# EAGLE design untitled (EAGLE 6.5.0)
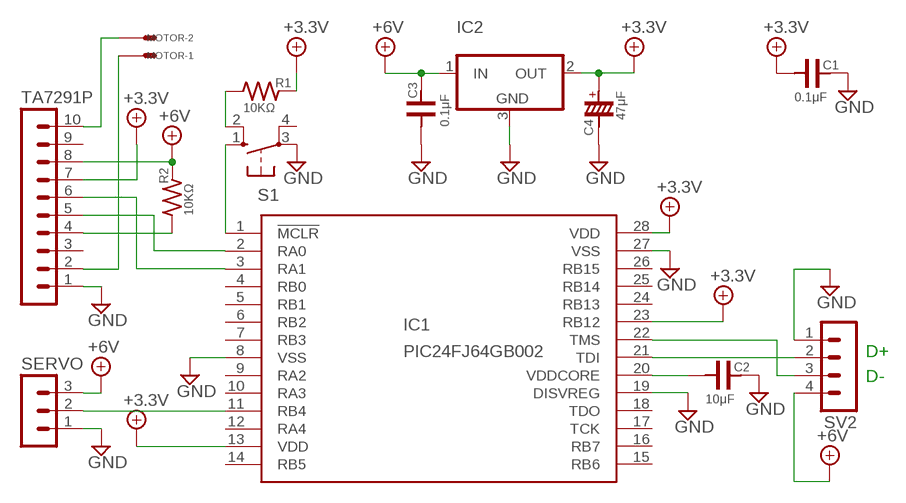
[diagram p0: schematic, sheet 1]

## Parts
C1  0.1μF  C25  [C25-25X44]
C2  10μF  C25  [C25-25X44]
C3  0.1μF  C25  [C25-25X44]
C4  47μF  POLCL  [TT2D5L]
IC1  PIC24FJ64GB002  [DIL28-3]
IC2  TA48MV  [HSIP3-P2.30B/V]
MOTOR  CON2S  [CON2]
R1  10KΩ  R  [0204/5]
R2  10KΩ  R  [0204/5]
S1  10-XX  [B3F-10XX]
SERVO  MA03-1  [MA03-1]
SV2  MA04-1  [MA04-1]
TA7291P  MA10-1  [MA10-1]

## Nets
+4.1V: C1.P$1 C4.P$1 IC1.13(VDD) IC1.23(RB12) IC1.28(VDD) IC2.2(OUT) R1.2 TA7291P.7 ; supply symbol labelled +3.3V
+5V: C3.P$2 IC2.1(IN) R2.2 SERVO.3 SV2.4 TA7291P.8 ; supply symbol labelled +6V
GND: C1.P$2 C2.P$2 C3.P$1 C4.P$2 IC1.8(VSS) IC1.19(DISVREG) IC1.27(VSS) IC2.3(GND) S1.3(P) SERVO.1 SV2.1 TA7291P.1
N$1: IC1.11(RB4) SERVO.2
N$2: R1.1 S1.2(S1)
N$3: IC1.1(!MCLR) S1.1(S)
N$4: C2.P$1 IC1.20(VDDCORE)
N$5: IC1.21(TDI) SV2.2
N$6: IC1.22(TMS) SV2.3
N$7: R2.1 TA7291P.4
N$8: IC1.2(RA0) TA7291P.5
N$9: IC1.3(RA1) TA7291P.6
N$10: MOTOR.P$1 TA7291P.2
N$11: MOTOR.P$2 TA7291P.10
Unconnected: IC1.4(RB0) IC1.5(RB1) IC1.6(RB2) IC1.7(RB3) IC1.9(RA2) IC1.10(RA3) IC1.12(RA4) IC1.14(RB5) IC1.15(RB6) IC1.16(RB7) IC1.17(TCK) IC1.18(TDO) IC1.24(RB13) IC1.25(RB14) IC1.26(RB15) S1.4(P1) TA7291P.3 TA7291P.9

## Notes on the sheet
- D+
- D-

## Library data of the parts
C1-C3 = 00_jikken:C
C4 = 00_jikken:POLC
IC1 = 00_microchip:PIC24FJ64GB002: PIC24FJ64GA002 edit this description Auto generated by make-symbol-device-package-bsdl.ulp Rev. 25 Source: PIC24FJ64GA002.bsd; MPN: PIC24FJ64GA002-I/SP; OC_FARNELL: 1332298; OC_NEWARK: 88K6132
IC2 = 00_kamiki:TA48M*: Three-Terminal Low Dropout Voltage Regulator
MOTOR = 00_jikken:CON2S
R1 R2 = 00_jikken:R
S1 = switch-omron:10-XX: OMRON SWITCH; MPN: B3F-1000; OC_FARNELL: 176432; OC_NEWARK: 36M3542
SERVO = 00_con-lstb:MA03-1: PIN HEADER; OC_FARNELL: unknown; OC_NEWARK: unknown
SV2 = 00_con-lstb:MA04-1: PIN HEADER; OC_FARNELL: unknown; OC_NEWARK: unknown
TA7291P = 00_con-lstb:MA10-1: PIN HEADER; OC_FARNELL: unknown; OC_NEWARK: unknown

## Board
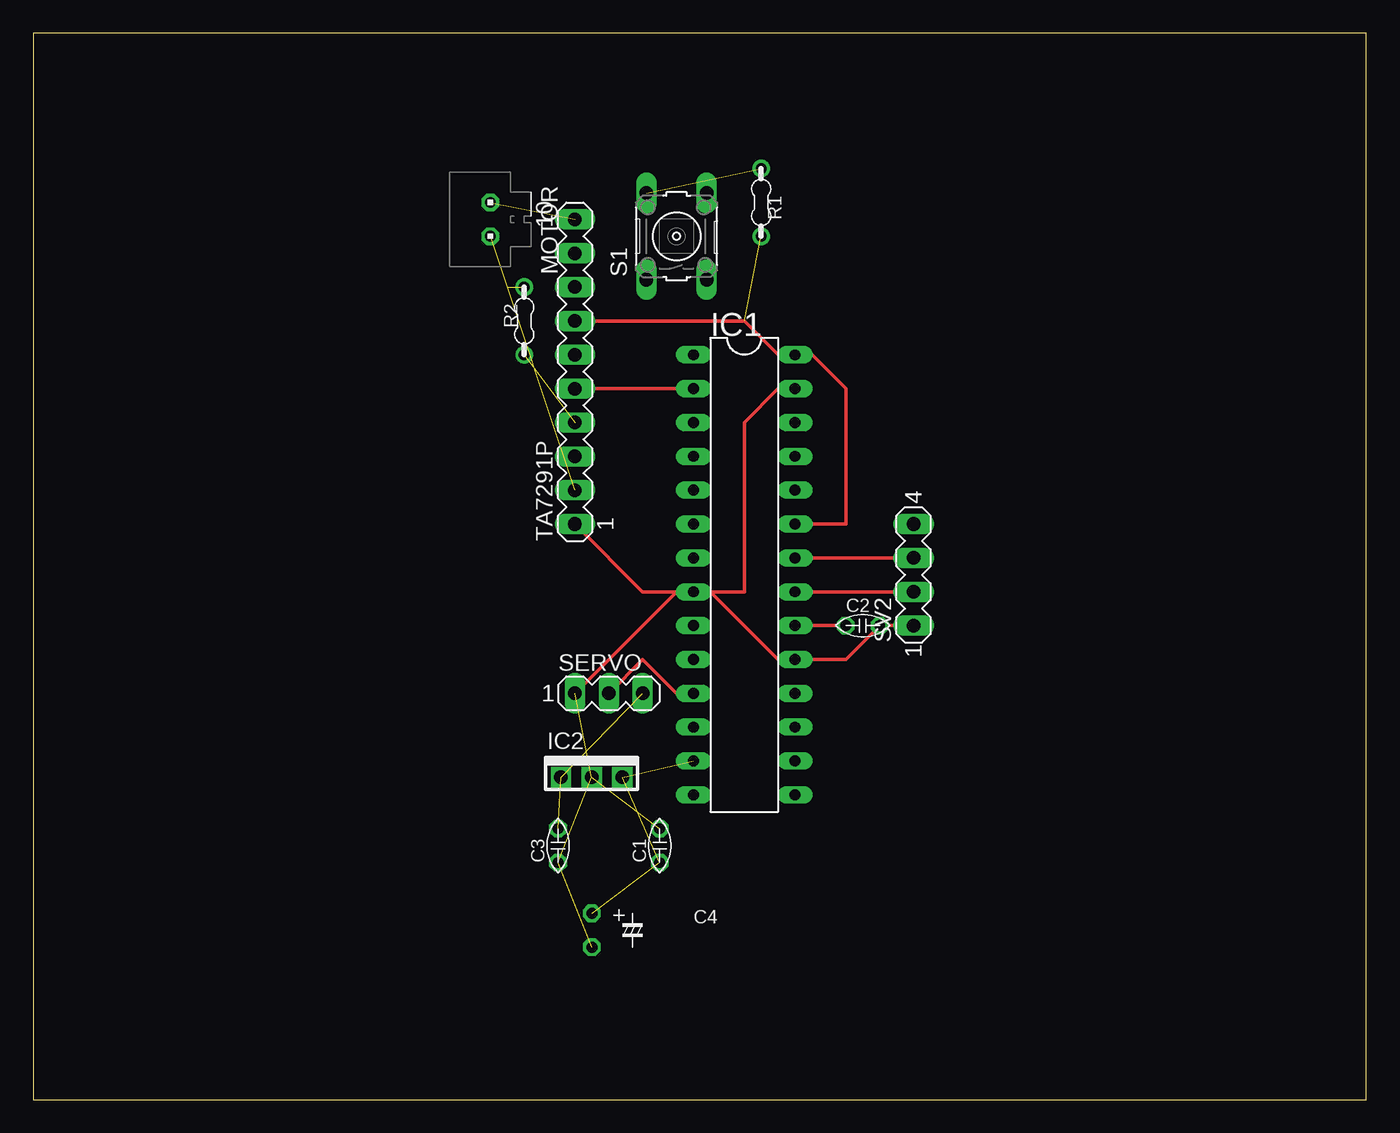
[diagram p1: board, top side]
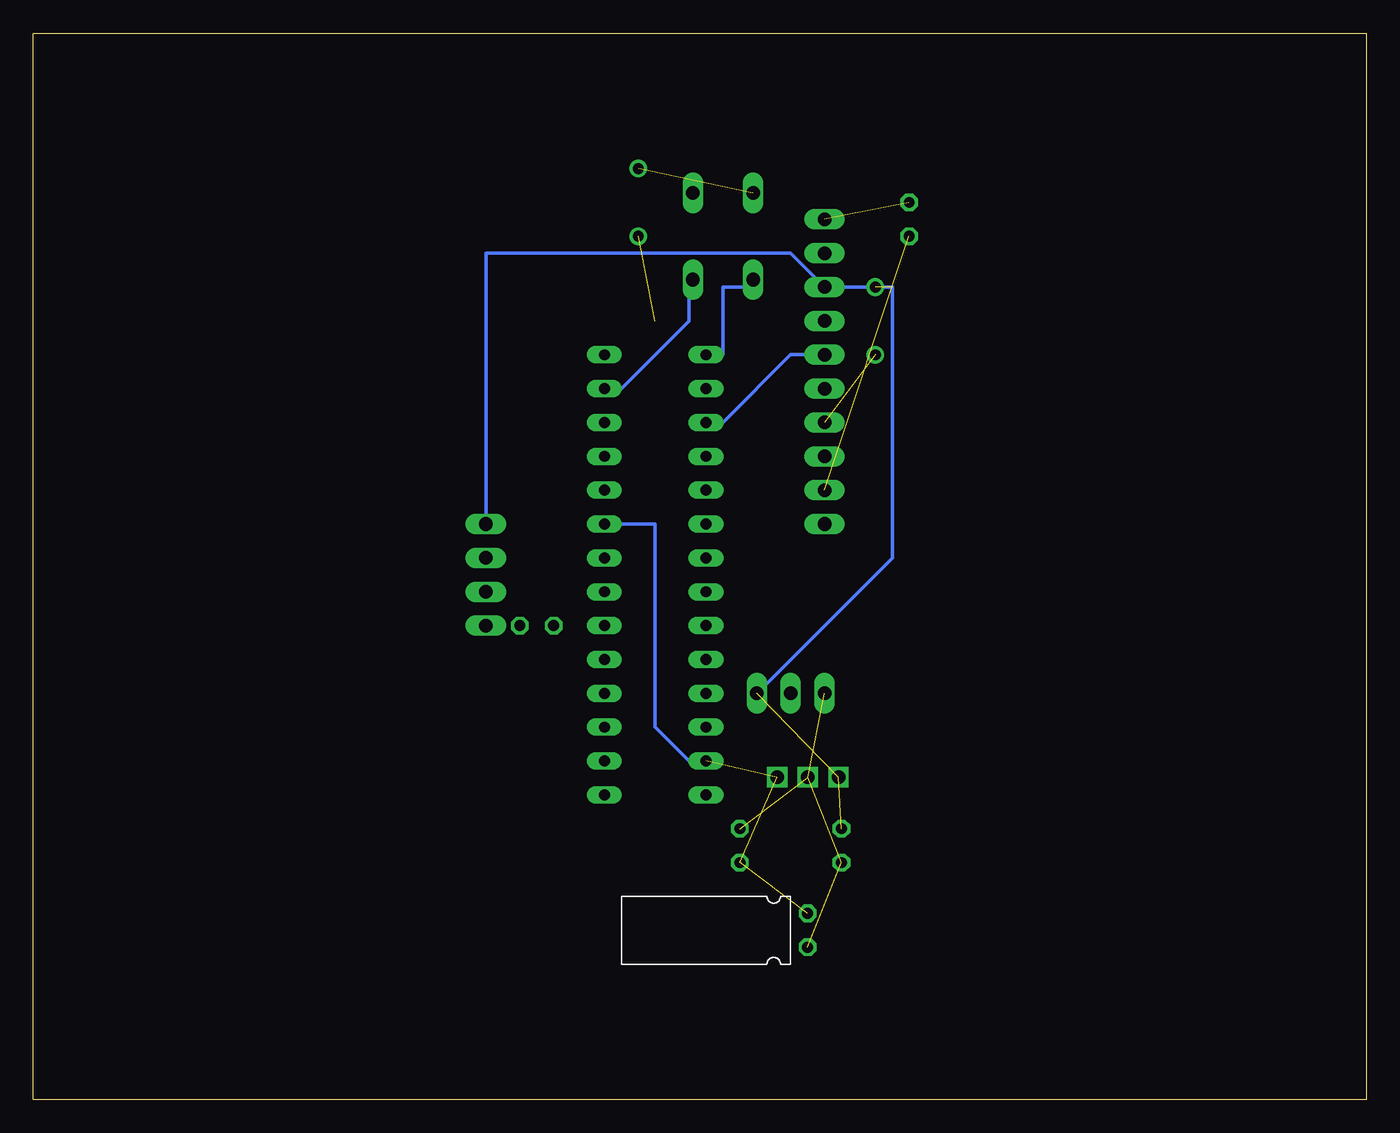
[diagram p2: board, bottom side, seen from below]

Size 100 x 80 mm. Coordinates in mm from the lower left corner, seen from the top.
Outline: 0,0 100,0 100,80 0,80 0,0
Copper layers (1*16): Top 0.035mm / dielectric 1.5mm / Bottom 0.035mm
Design rules "default": minimum track width 10mil, minimum drill 24mil, track to track 8mil, track to pad 8mil, pad to pad 8mil, via to via 8mil, smd to smd 8mil, copper to edge 40mil, drill to drill 8mil, minimum pad ring 10mil, minimum via ring 8mil, stop-mask expansion 4mil, vias tented up to drill 0mil, thermal gap 10mil

### Footprints (pad centres in the part's own frame; a part is rotated, then mirrored left to right if it is on the bottom)
C25-25X44 = drill 0.813 octagon: P$1 -1.27,0; P$2 1.27,0
TT2D5L = drill 0.813 octagon: P$1 0,2.54; P$2 0,0
DIL28-3 = drill 0.813 long: 1 -16.51,-3.81; 2 -13.97,-3.81; 3 -11.43,-3.81; 4 -8.89,-3.81; 5 -6.35,-3.81; 6 -3.81,-3.81; 7 -1.27,-3.81; 8 1.27,-3.81; 9 3.81,-3.81; 10 6.35,-3.81; 11 8.89,-3.81; 12 11.43,-3.81; 13 13.97,-3.81; 14 16.51,-3.81; 15 16.51,3.81; 16 13.97,3.81; 17 11.43,3.81; 18 8.89,3.81; 19 6.35,3.81; 20 3.81,3.81; 21 1.27,3.81; 22 -1.27,3.81; 23 -3.81,3.81; 24 -6.35,3.81; 25 -8.89,3.81; 26 -11.43,3.81; 27 -13.97,3.81; 28 -16.51,3.81
HSIP3-P2.30B/V = drill 1.016 square: 1 -2.32,0.05; 2 2.28,0.05; 3 -0.02,0.05
CON2 = drill 0.813 octagon: P$1 1.27,0; P$2 -1.27,0
0204/5 = drill 0.813: 1 -2.54,0; 2 2.54,0
B3F-10XX = drill 1.016 long: 1 -3.251,2.261; 2 3.251,2.261; 3 -3.251,-2.261; 4 3.251,-2.261
MA03-1 = drill 1.016 long: 1 -2.54,0; 2 0,0; 3 2.54,0
MA04-1 = drill 1.016 long: 1 -3.81,0; 2 -1.27,0; 3 1.27,0; 4 3.81,0
MA10-1 = drill 1.016 long: 1 -11.43,0; 2 -8.89,0; 3 -6.35,0; 4 -3.81,0; 5 -1.27,0; 6 1.27,0; 7 3.81,0; 8 6.35,0; 9 8.89,0; 10 11.43,0

### Placement (x,y rotation side)
C1  46.99,19.05 90 top
C2  62.23,35.56 0 top
C3  39.37,19.05 90 top
C4  41.91,11.43 0 top
IC1  53.34,39.37 270 top
IC2  41.91,24.13 0 top
MOTOR  34.29,66.04 270 top
R1  54.61,67.31 270 top
R2  36.83,58.42 90 top
S1  48.26,64.77 90 top
SERVO  43.18,30.48 0 top
SV2  66.04,39.37 90 top
TA7291P  40.64,54.61 90 top

### Tracks (layer width: path | path; a pad name or v marks a point on that pad's centre or on a via)
+4.1V  (4 unrouted)
  Top 0.254: TA7291P.7 53.34,58.42 55.88,55.88 IC1.28 58.42,55.88 60.96,53.34 60.96,43.18 IC1.23
  Bottom 0.254: IC1.23 53.34,43.18 53.34,27.94 50.8,25.4 IC1.13
+5V  (3 unrouted)
  Bottom 0.254: SERVO.3 35.56,40.64 35.56,60.96 TA7291P.8 43.18,63.5 66.04,63.5 SV2.4
GND  (4 unrouted)
  Top 0.254: SV2.1 C2.P$2 60.96,33.02 IC1.19 55.88,33.02 50.8,38.1 | 48.26,38.1 SERVO.1 | TA7291P.1 45.72,38.1 48.26,38.1 | 48.26,38.1 IC1.8 50.8,38.1 | 50.8,38.1 53.34,38.1 53.34,50.8 55.88,53.34 IC1.27
  Bottom 0.254: IC1.27 55.88,53.34 50.8,58.42 50.8,60.96 S1.3
N$1
  Top 0.254: SERVO.2 45.72,33.02 48.26,30.48 IC1.11
N$2  (1 unrouted)
N$3
  Bottom 0.254: IC1.1 48.26,55.88 48.26,60.96 45.72,60.96 S1.1
N$4
  Top 0.254: C2.P$1 IC1.20
N$5
  Top 0.254: SV2.2 IC1.21
N$6
  Top 0.254: SV2.3 IC1.22
N$7  (1 unrouted)
N$8
  Top 0.254: TA7291P.5 IC1.2
N$9
  Bottom 0.254: TA7291P.6 43.18,55.88 48.26,50.8 IC1.3
N$10  (1 unrouted)
N$11  (1 unrouted)